# Altium schematic sheet MCU_WL.SchDoc
size A4; SheetNumber: 6; SheetTotal: 6
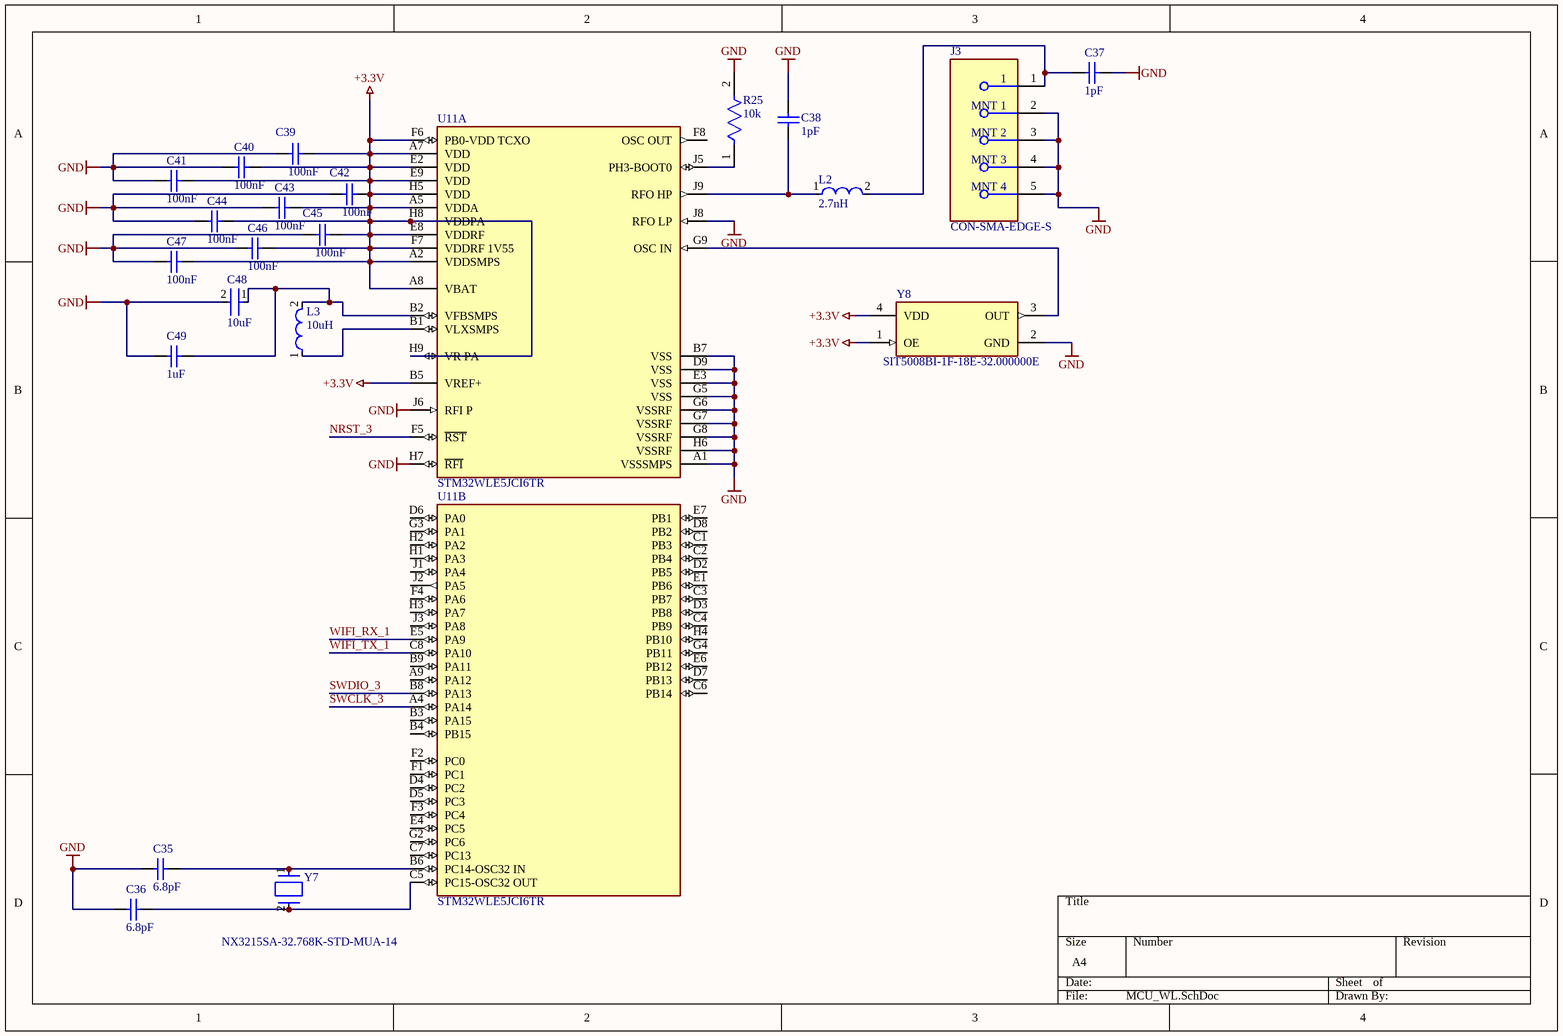
[diagram p0: MCU_WL.SchDoc]

## Parts
C35  6.8pF  [CAPC2013X94X50NL20T25]
C36  6.8pF  [CAPC2013X94X50NL20T25]
C37  1pF  [CAPC0402(1005)60_M]
C38  1pF  [CAPC0402(1005)60_M]
C39  100nF  [CAPC2013X140X50ML20T25]
C40  100nF  [CAPC2013X140X50ML20T25]
C41  100nF  [CAPC2013X140X50ML20T25]
C42  100nF  [CAPC2013X140X50ML20T25]
C43  100nF  [CAPC2013X140X50ML20T25]
C44  100nF  [CAPC2013X140X50ML20T25]
C45  100nF  [CAPC2013X140X50ML20T25]
C46  100nF  [CAPC2013X140X50ML20T25]
C47  100nF  [CAPC2013X140X50ML20T25]
C48  10uF  [FP-C1206C-EH-MFG]
C49  1uF  [CAPC2013X145X50NL20T20]
J3  CON-SMA-EDGE-S  [FP-CON-SMA-EDGE-S-MFG]
L2  2.7nH  [FP-LQW15AN_80-MFG]
L3  10uH  [FP-NRS6010-MFG]
R25  10k  [FP-CRGP0805-IPC_C]
U11  STM32WLE5JCI6TR  [FP-B08E_UFBGA73_ME-MFG]  (parts A,B of 2)
Y7  NX3215SA-32.768K-STD-MUA-14  [FP-NX3215SA-MFG]
Y8  SIT5008BI-1F-18E-32.000000E  [FP-SiT5008-1-MFG]

## Nets
+3.3V: C39.2 C40.2 C41.2 C42.2 C43.2 C44.2 C45.2 C46.2 C47.2 U11.A2(VDDSMPS) U11.A5(VDDA) U11.A7(VDD) U11.A8(VBAT) U11.B5(VREF+) U11.E2(VDD) U11.E8(VDDRF) U11.E9(VDD) U11.F6(PB0-VDD_TCXO) U11.F7(VDDRF_1V55) U11.H5(VDD) U11.H8(VDDPA) U11.H9(VR_PA) Y8.1(OE) Y8.4(VDD)
GND: C35.2 C36.1 C37.2 C38.2 C39.1 C40.1 C41.1 C42.1 C43.1 C44.1 C45.1 C46.1 C47.1 C48.2 C49.2 J3.2(MNT_1) J3.3(MNT_2) J3.4(MNT_3) J3.5(MNT_4) R25.2 U11.A1(VSSSMPS) U11.B7(VSS) U11.D9(VSS) U11.E3(VSS) U11.G5(VSS) U11.G6(VSSRF) U11.G7(VSSRF) U11.G8(VSSRF) U11.H6(VSSRF) U11.H7(~{RFI}) U11.J6(RFI_P) U11.J8(RFO_LP) Y8.2(GND)
NRST_3: U11.F5(~{RST})
SWCLK_3: U11.A4(PA14)
SWDIO_3: U11.B8(PA13)
WIFI_RX_1: U11.E5(PA9)
WIFI_TX_1: U11.C8(PA10)
NetC35_1: C35.1 U11.B6(PC14-OSC32_IN) Y7.1
NetC36_2: C36.2 U11.C5(PC15-OSC32_OUT) Y7.2
NetC37_1: C37.1 J3.1 L2.2
NetC38_1: C38.1 L2.1 U11.J9(RFO_HP)
NetC48_1: C48.1 C49.1 L3.2 U11.B2(VFBSMPS)
NetL3_1: L3.1 U11.B1(VLXSMPS)
NetR25_1: R25.1 U11.J5(PH3-BOOT0)
NetU11_G9: U11.G9(OSC_IN) Y8.3(OUT)

Not connected (* = marked no-connect by the designer): U11 A9(PA12) B3(PA15) B4(PB15) B9(PA11) C1(PB3) C2(PB4) C3(PB7) C4(PB9) C6(PB14) C7(PC13) D2(PB5) D3(PB8) D4(PC2) D5(PC3) D6(PA0) D7(PB13) D8(PB2) E1(PB6) E4(PC5) E6(PB12) E7(PB1) F1(PC1) F2(PC0) F3(PC4) F4(PA6) F8(OSC_OUT) G2(PC6) G3(PA1) G4(PB11) H1(PA3) H2(PA2) H3(PA7) H4(PB10) J1(PA4) J2(PA5) J3(PA8)

## Library data of the parts
C35 C36 = CMP-2007-04154-1: Part Number: 08051A6R8DAT2A; Manufacturer: AVX Interconnect / Elco
C37 C38 = CMP-1034-00052-1: CAP 1pF 16V ±0.5pF 0402 (1005 Metric) Thickness 0.6mm SMD; Case-EIA: 0402; Tolerance: Â±0.5pF; Case-Metric: 1005; Rated Voltage: 16 V; Technology: SMT; Max Thickness: 0.6 mm; Value: 1pF
C39-C47 = CMP-2007-04651-1: Part Number: 0805DD104KAT2A; Manufacturer: AVX Interconnect / Elco
C48 = CMP-03020-004605-1: CAP CER 10UF 25V X7R 1206; Manufacturer Part Number: C1206C106K3RACAUTO; Manufacturer: KEMET; Material: Ceramic; Automotive Grade: Grade 1; Temperature Coefficient: 15%; Tolerance: 10%; Digikey Description: CAP CER 10UF 25V X7R 1206; Lead Free: Yes; Temperature Characteristic: X7R; Temperature: -55°C to +125°C; Temperature Range Low: -55°C; Octopart: https://octopart.com/c1206c106k3racauto-kemet-65707106; Temperature Range High: +125°C; RoHS: TRUE; Package: C1206C-EH; Device Class L1: Passive Components; Device Class L3: Ceramic Capacitors; Automotive: Yes; Value: 10uF; Category: Cap; ComponentLink2Description: Datasheet; Capacitance: 10uF; Height: 1.8mm; ComponentLink2URL: https://content.kemet.com/datasheets/KEM_C1023_X7R_AUTO_SMD.pdf; Voltage Rating: 25V; Device Class L2: Capacitors; Ipc Land Pattern Name: CAPC320160X160
C49 = CMP-2007-01676-1: Part Number: VJ0805Y105KXQRW1BC; Manufacturer: Vitramon
J3 = CMP-204357-000001-1: CONN SMA JACK STR EDGE MNT; Manufacturer: RF Solutions Ltd.; Impedance: 50Ω; Conn Orientation: Right Angle; Is Female: yes; Number Of Contacts: 1; Frequency: 18GHz; Shielding: true; Category: Conn; ComponentLink2URL: https://www.rfsolutions.co.uk/downloads/1498648656DS-CON-EDGE-SMA-4.pdf; Octopart: https://octopart.com/con-sma-edge-s-rf+solutions-70967450; Package: CONN_JACK; Manufacturer Part Number: CON-SMA-EDGE-S; Height: 6.35mm; Device Class L1: Connectors; Footprint Url: https://forum.upverter.com/uploads/default/original/3X/b/e/be75b907af57498775929d6d9099689c472e0307.pdf; Contact Material: Gold; ComponentLink2Description: Datasheet; Device Class L2: RF / Coaxial Connectors; RoHS: TRUE; Device Class L3: unset; Digikey Description: CONN SMA JACK STR EDGE MNT; Lead Free: Yes; Automotive: No
L2 = CMP-06042-005175-1: Wire Wound RF Inductor 2.7nH ±0.2nH 1500mA 0.047Ω 0402 (1005); Core Material: Ferrite; Test Frequency: 100MHz; Self Resonant Frequency: 14GHz; Shielding: Unshielded; Q Factor: 28; Current Rating: 1.5A; DC Resistance (DCR): 47mR; Case/Package: 0402; Mount: Surface Mount; Height: 0.5mm; Termination: SMD/SMT; Min Operating Temperature: -55°C; Max Operating Temperature: 125°C; Width: 0.024inch; Resistor Type: Wirewound; Height - Seated (Max): 0.024inch; Case Code (Metric): 1005; Inductance: 2.7nH; Max DC Current: 1.5A; Case Code (Imperial): 0402; Package Quantity: 10000; Packaging: Tape and Reel; Length: 0.039inch
L3 = CMP-14484-000971-1: Inductor Power Shielded Wirewound 2.2uH 20% 100KHz Ferrite 1.7A 0.132Ω DCR T/R; Self Resonant Frequency: 56MHz; Max DC Current: 1.9A; DC Resistance (DCR): 132mR; Height - Seated (Max): 0.039inch; Number of Pins: 2; Width: 6mm; Case Code (Imperial): 2304; Min Operating Temperature: -25°C; Case Code (Metric): 6010; Tolerance: 20%; Inductance: 2.2uH; Shielding: Shielded; Core Material: Ferrite; Current Rating: 1.7A; Lead Pitch: 4mm; Test Frequency: 100kHz; RoHS Compliant: Yes; Saturation Current: 1.9A; Resistor Type: Wirewound; Packaging: Tape and Reel; Termination: SMD/SMT; Max Operating Temperature: 125°C; Height: 1mm; Package Quantity: 1; Inductance Tolerance: 20%; Series: NRS; Radiation Hardening: No; Lead Free: Lead Free; Case/Package: 2304; RMS Current (Irms): 1.7A; Length: 6mm; Halogen Free: Halogen Free; Depth: 6.2mm; Mount: Surface Mount
R25 = CMP-03211-006861-1: CRGP 0805 10K 1%; Manufacturer Part Number: CRGP0805F10K; Manufacturer: TE; Power Rating: 0.33W; Voltage Rating: 150V; Value: 10KΩ; Tolerance: 0.01; Temperature Coefficient: ±100ppm/°C; ComponentLink2URL: https://www.mouser.com/datasheet/2/418/NG_DS_9-1773463-9_A-1358566.pdf; Temperature Range Low: -55°C; Ipc Land Pattern Name: RESC200125X55; Device Class L2: Resistors; Automotive: No; Device Class L3: Chip SMD Resistors; Composition: Thick Film; Temperature Range High: +155°C; Temperature: -55°C to +155°C; Height: 0.65mm; Series: CRGP; RoHS: TRUE; Device Class L1: Passive Components; Octopart: https://octopart.com/crgp0805f10k-te+connectivity-91018782; Package: CRGP0805; Digikey Description: CRGP 0805 10K 1%; Ambient Temperature Range High: +70°C; Lead Free: Yes; ComponentLink2Description: Datasheet; Category: Res; Resistance: 10KΩ
U11 = CMP-12105-000091-1: Sub-GHz Wireless Microcontrollers. Arm Cortex-M4 @48 MHz with 256 Kbytes of Flash memory, 64 Kbytes of SRAM. LoRa, (G)FSK, (G)MSK, BPSK modulations. AES 256-bit. Multiprotocol System-on-Chip.
Y7 = CMP-00536-22488149-1: NX3215SA-32.768K-STD-MUA-14 Parallel - Fundamental Quartz Crystal, 0.032768MHz Nom; ESR (Equivalent Series Resistance): 70kΩ; Frequency Tolerance: 0.002%; Load Capacitance: 6pF; Frequency: 32.768kHz; Width: 1.4986mm; Length: 3.2004mm; RoHS: Compliant; Case/Package: SMD/SMT; Mount: Surface Mount; Height: 889µm; Number of Pins: 2; Packaging: Tape & Reel (TR); Max Operating Temperature: 85°C; NexarPartId: 22488149; Min Operating Temperature: -40°C
Y8 = CMP-25159-265556-1: Temperature Compensated Crystal Oscillator (TCXO) 32MHz ±3.5ppm LVCMOS/HCMOS 4-Pin SMD T/R